# EAGLE design servostik (EAGLE 5.07)
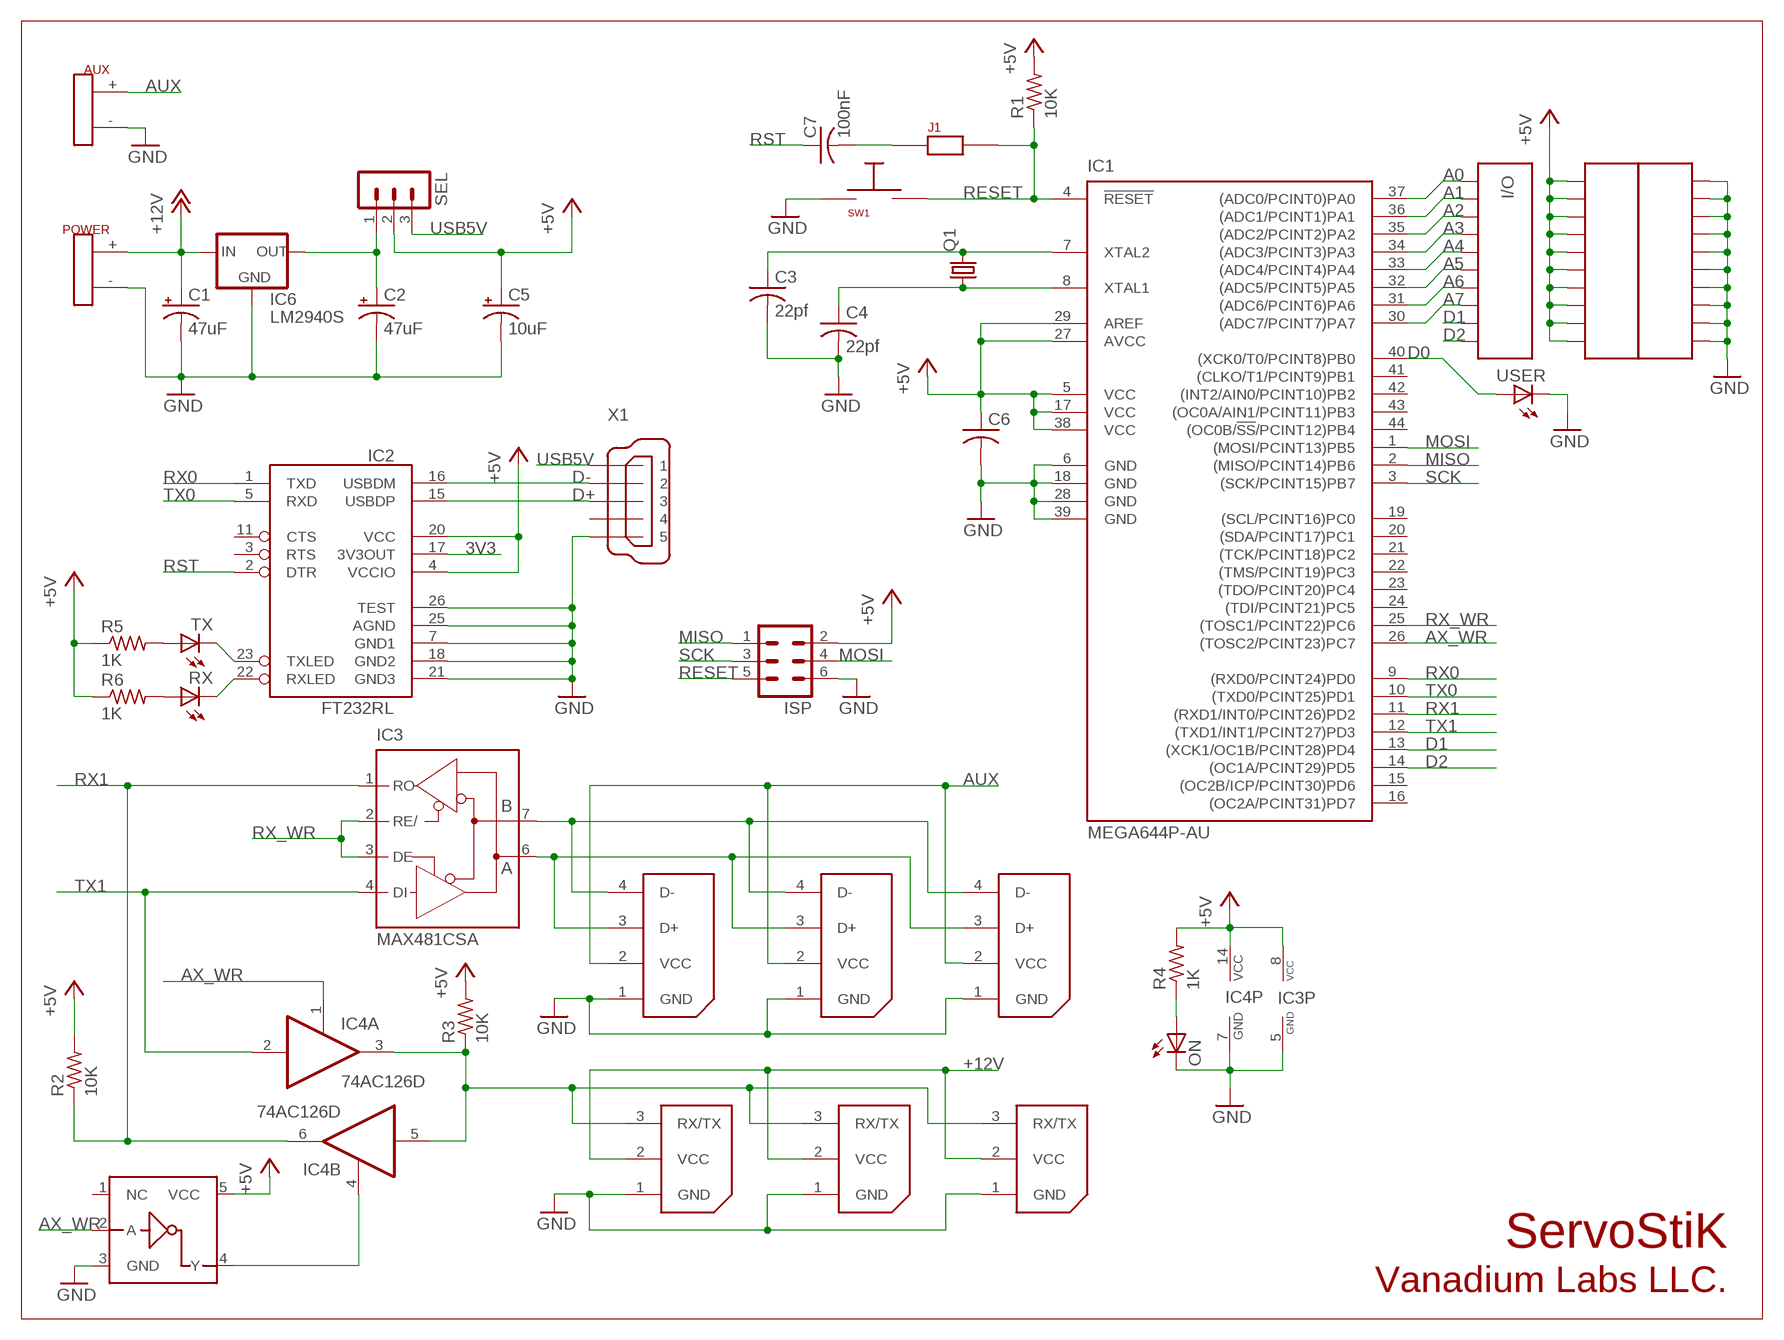
[diagram p0: schematic, sheet 1]

## Parts
AUX  POWER  [POWER]
AX1  WM18887-ND  [BIOLOID]
AX2  WM18887-ND  [BIOLOID]
AX3  WM18887-ND  [BIOLOID]
C1  47uF  CPOL-USTT2D5  [TT2D5]
C2  47uF  CPOL-USTT2D5  [TT2D5]
C3  22pf  C-USC0603  [C0603]
C4  22pf  C-USC0603  [C0603]
C5  10uF  CPOL-USTT2D5  [TT2D5]
C6  C-USC0603  [C0603]
C7  100nF  C-USC0603  [C0603]
IC1  MEGA644P-AU  MEGA164P/324P/644P-AU  [TQFP44]
IC2  FT232RL  FT232RL-BASICSSOP  [SSOP28DB]
IC3  MAX481CSA  [SO08]
IC4  74AC126D  [SO14]
IC5  TC7S04F  [SSOP5-0.95]
IC6  LM2940S  [TO220S]
ISP  MA03-2  [MA03-2]
J1  JUMPER  [2-PIN]
ON  LEDCHIP-LED0805  [CHIP-LED0805]
POWER  POWER  [POWER]
Q1  HC49/S  [HC49/S]
R1  10K  R-US_R0805  [R0805]
R2  10K  R-US_R0805  [R0805]
R3  10K  R-US_R0805  [R0805]
R4  1K  R-US_R0805  [R0805]
R5  1K  R-US_R0603  [R0603]
R6  1K  R-US_R0603  [R0603]
RX  LEDCHIP-LED0603  [CHIP-LED0603]
RX1  RX-64  [WM18888-ND]
RX2  RX-64  [WM18888-ND]
RX3  RX-64  [WM18888-ND]
SEL  MA03-1  [MA03-1]
SW1  400-1646-ND  [MINISW]
TX  LEDCHIP-LED0603  [CHIP-LED0603]
U$1  HEADER1X10  [1X10]
U$2  HEADER1X10  [1X10]
U$4  HEADER1X10  [1X10]
USER  LEDCHIP-LED0805  [CHIP-LED0805]
X1  MINI-USB-UX60-MB-5ST  [UX60-MB-5ST]

## Nets
3V3: IC2.17(3V3OUT)
+5V: C5.+ C6.1 IC1.5(VCC) IC1.17(VCC) IC1.27(AVCC) IC1.29(AREF) IC1.38(VCC) IC2.4(VCCIO) IC2.20(VCC) IC3.8(VCC) IC4.14(P:VCC) IC5.5(VCC) ISP.2 R1.2 R2.2 R3.2 R4.2 R5.1 R6.1 SEL.2 U$2.P$1 U$2.P$2 U$2.P$3 U$2.P$4 U$2.P$5 U$2.P$6 U$2.P$7 U$2.P$8 U$2.P$9 U$2.P$10
+12V: AX1.2(VCC) AX2.2(VCC) AX3.2(VCC) C1.+ IC6.1(IN) POWER.+
A0: IC1.37((ADC0/PCINT0)PA0) U$1.P$1
A1: IC1.36((ADC1/PCINT1)PA1) U$1.P$2
A2: IC1.35((ADC2/PCINT2)PA2) U$1.P$3
A3: IC1.34((ADC3/PCINT3)PA3) U$1.P$4
A4: IC1.33((ADC4/PCINT4)PA4) U$1.P$5
A5: IC1.32((ADC5/PCINT5)PA5) U$1.P$6
A6: IC1.31((ADC6/PCINT6)PA6) U$1.P$7
A7: IC1.30((ADC7/PCINT7)PA7) U$1.P$8
AUX: AUX.+ RX1.2(VCC) RX2.2(VCC) RX3.2(VCC)
AX_WR: IC1.26((TOSC2/PCINT23)PC7) IC4.1(A:OE) IC5.2(A)
D0: IC1.40((XCK0/T0/PCINT8)PB0) USER.A
D1: IC1.13((XCK1/OC1B/PCINT28)PD4) U$1.P$9
D2: IC1.14((OC1A/PCINT29)PD5) U$1.P$10
D+: IC2.15(USBDP) X1.3
D-: IC2.16(USBDM) X1.2
GND: AUX.- AX1.1(GND) AX2.1(GND) AX3.1(GND) C1.- C2.- C3.2 C4.2 C5.- C6.2 IC1.6(GND) IC1.18(GND) IC1.28(GND) IC1.39(GND) IC2.7(GND1) IC2.18(GND2) IC2.21(GND3) IC2.25(AGND) IC2.26(TEST) IC3.5(GND) IC4.7(P:GND) IC5.3(GND) IC6.2(GND) ISP.6 ON.C POWER.- RX1.1(GND) RX2.1(GND) RX3.1(GND) SW1.2 U$4.P$1 U$4.P$2 U$4.P$3 U$4.P$4 U$4.P$5 U$4.P$6 U$4.P$7 U$4.P$8 U$4.P$9 U$4.P$10 USER.C X1.5
MISO: IC1.2((MISO/PCINT14)PB6) ISP.1
MOSI: IC1.1((MOSI/PCINT13)PB5) ISP.4
N$1: C3.1 IC1.7(XTAL2) Q1.2
N$2: IC3.7(B) RX1.4(D-) RX2.4(D-) RX3.4(D-)
N$3: AX1.3(RX/TX) AX2.3(RX/TX) AX3.3(RX/TX) IC4.3(A:O) IC4.5(B:I) R3.1
N$4: C4.1 IC1.8(XTAL1) Q1.1
N$7: C7.2 J1.P$1
N$8: IC4.4(B:OE) IC5.4(Y)
N$10: R6.2 RX.A
N$11: R5.2 TX.A
N$12: IC3.6(A) RX1.3(D+) RX2.3(D+) RX3.3(D+)
N$17: C2.+ IC6.3(OUT) SEL.1
N$44: IC2.23(TXLED) TX.C
N$45: IC2.22(RXLED) RX.C
N$47: ON.A R4.1
RESET: IC1.4(!RESET) ISP.5 J1.P$2 R1.1 SW1.1
RST: C7.1 IC2.2(DTR)
RX0: IC1.9((RXD0/PCINT24)PD0) IC2.1(TXD)
RX1: IC1.11((RXD1/INT0/PCINT26)PD2) IC3.1(RO) IC4.6(B:O) R2.1
RX_WR: IC1.25((TOSC1/PCINT22)PC6) IC3.2(RE/) IC3.3(DE)
SCK: IC1.3((SCK/PCINT15)PB7) ISP.3
TX0: IC1.10((TXD0/PCINT25)PD1) IC2.5(RXD)
TX1: IC1.12((TXD1/INT1/PCINT27)PD3) IC3.4(DI) IC4.2(A:I)
USB5V: SEL.3 X1.1
Unconnected: IC1.15((OC2B/ICP/PCINT30)PD6) IC1.16((OC2A/PCINT31)PD7) IC1.19((SCL/PCINT16)PC0) IC1.20((SDA/PCINT17)PC1) IC1.21((TCK/PCINT18)PC2) IC1.22((TMS/PCINT19)PC3) IC1.23((TDO/PCINT20)PC4) IC1.24((TDI/PCINT21)PC5) IC1.41((CLKO/T1/PCINT9)PB1) IC1.42((INT2/AIN0/PCINT10)PB2) IC1.43((OC0A/AIN1/PCINT11)PB3) IC1.44((OC0B/!SS!/PCINT12)PB4) IC2.3(RTS) IC2.11(CTS) IC4.8(C:O) IC4.9(C:I) IC4.10(C:OE) IC4.11(D:O) IC4.12(D:I) IC4.13(D:OE) IC5.1(NC) X1.4

## Notes on the sheet
- I/O
- ServoStiK
- Vanadium Labs LLC.

## Library data of the parts
AUX POWER = robots:POWER
AX1-AX3 = robots:WM18887-ND: Bioloid Bus Header Digikey Part No: WM18887-ND Molex/Waldom Electronics Corp 22-03-5035
C1 C2 C5 = rcl:CPOL-US: POLARIZED CAPACITOR, American symbol
C3 C4 C6 C7 = rcl:C-US: CAPACITOR, American symbol
IC1 = avr:MEGA164P/324P/644P-AU
IC2 = SparkFun:FT232RL-BASIC: USB UART This is the simplified version of the FT232RL unit. Only what you need, nothing you don't. Spark Fun Electronics SKU : COM-00650
IC3 = maxim:MAX481CSA: RS485 TRANSEIVER
IC4 = 74xx-eu:74*126: Quad bus BUFFER, 3-state
IC5 = robots:TC7S04F
IC6 = robots:LM2940: LM2940 LDO REGULATOR
ISP = con-lstb:MA03-2: PIN HEADER
J1 = robots:JUMPER
ON RX TX USER = led:LED: LED OSRAM: - CHIPLED LG R971, LG N971, LY N971, LG Q971, LY Q971, LO R971, LY R971 LH N974, LH R974 LS Q976, LO Q976, LY Q976 LO Q996 - Hyper CHIPLED LW Q18S LB Q993, LB Q99A, LB R99A - SideLED LS A670, LO A670, LY A670, LG A670, LP A670 LB A673, LV A673, LT A673, LW A673 LH A674 LY A675 LS A676, LA A676, LO A676, LY A676, LW A676 LS A679, LY A679, LG A679 - Hyper Micro SIDELED® LS Y876, LA Y876, LO Y876, LY Y876 LT Y87S - SmartLED LW L88C, LW L88S LB L89C, LB L89S, LG L890 LS L89K, LO L89K, LY L89K LS L896, LA L896, LO L896, LY L896 - TOPLED LS T670, LO T670, LY T670, LG T670, LP T670 LSG T670, LSP T670, LSY T670, LOP T670, LYG T670 LG T671, LOG T671, LSG T671 LB T673, LV T673, LT T673, LW T673 LH T674 LS T676, LA T676, LO T676, LY T676, LB T676, LH T676, LSB T676, LW T676 LB T67C, LV T67C, LT T67C, LS T67K, LO T67K, LY T67K, LW E67C LS E67B, LA E67B, LO E67B, LY E67B, LB E67C, LV E67C, LT E67C LW T67C LS T679, LY T679, LG T679 LS T770, LO T770, LY T770, LG T770, LP T770 LB T773, LV T773, LT T773, LW T773 LH T774 LS E675, LA E675, LY E675, LS T675 LS T776, LA T776, LO T776, LY T776, LB T776 LHGB T686 LT T68C, LB T68C - Hyper Mini TOPLED® LB M676 - Mini TOPLED Santana® LG M470 LS M47K, LO M47K, LY M47K Source: http://www.osram.convergy.de LUXEON: - LUMILED® LXK2-PW12-R00, LXK2-PW12-S00, LXK2-PW14-U00, LXK2-PW14-V00 LXK2-PM12-R00, LXK2-PM12-S00, LXK2-PM14-U00 LXK2-PE12-Q00, LXK2-PE12-R00, LXK2-PE12-S00, LXK2-PE14-T00, LXK2-PE14-U00 LXK2-PB12-K00, LXK2-PB12-L00, LXK2-PB12-M00, LXK2-PB14-N00, LXK2-PB14-P00, LXK2-PB14-Q00 LXK2-PR12-L00, LXK2-PR12-M00, LXK2-PR14-Q00, LXK2-PR14-R00 LXK2-PD12-Q00, LXK2-PD12-R00, LXK2-PD12-S00 LXK2-PH12-R00, LXK2-PH12-S00 LXK2-PL12-P00, LXK2-PL12-Q00, LXK2-PL12-R00 Source: www.luxeon.com KINGBRIGHT: KA-3528ASYC Source: www.kingbright.com
Q1 = crystal:HC49/S: CRYSTAL
R1-R6 = rcl:R-US_: RESISTOR, American symbol
RX1-RX3 = robots:RX-64
SEL = con-lstb:MA03-1: PIN HEADER
SW1 = robots:400-1646-ND: Mini Switch
U$1 U$2 U$4 = robots:HEADER1X10
X1 = con-hirose:MINI-USB-: MINI USB Connector Source: http://www.hirose.co.jp/cataloge_hp/e24000019.pdf

## Board
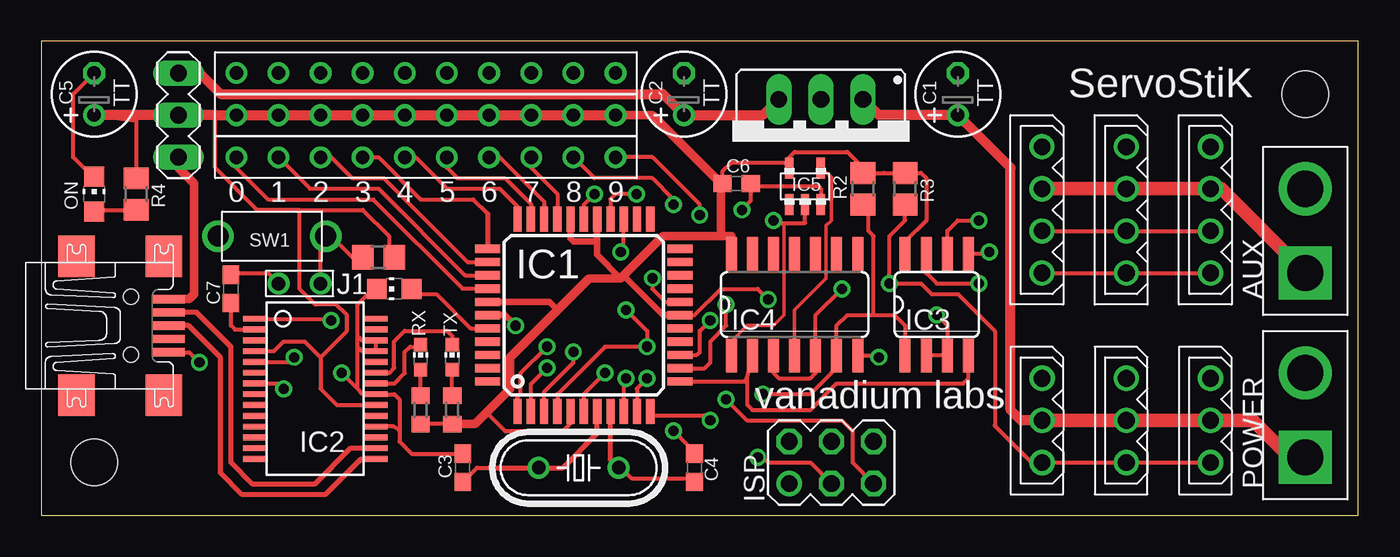
[diagram p1: board, top side]
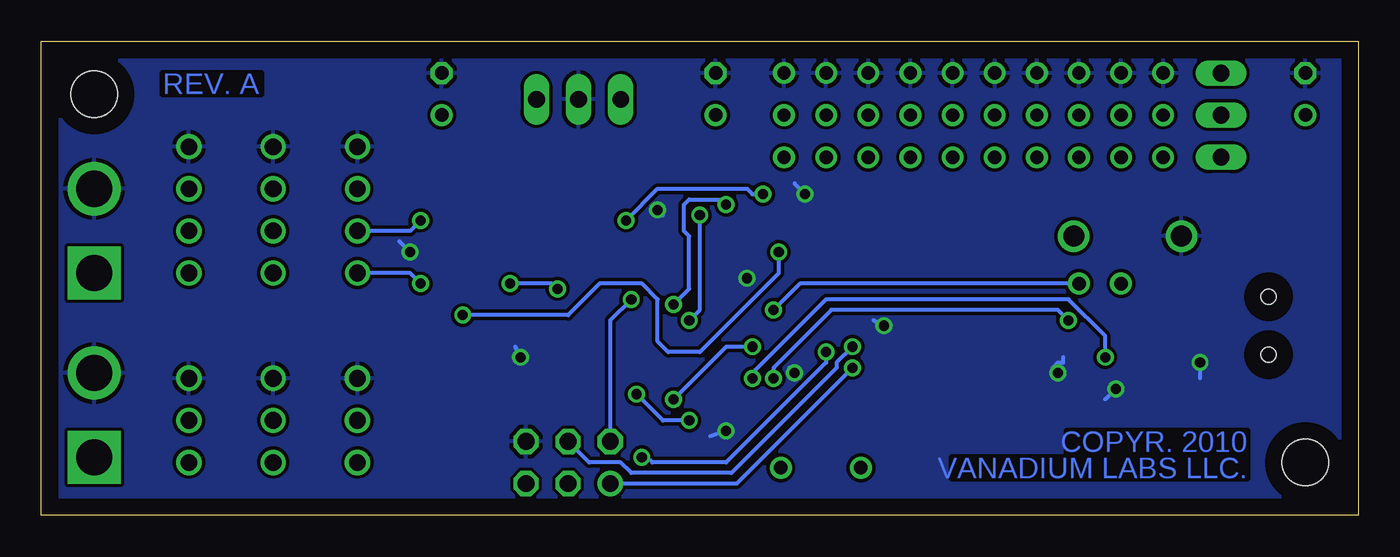
[diagram p2: board, bottom side, seen from below]

Size 79.38 x 28.57 mm. Coordinates in mm from the lower left corner, seen from the top.
Outline: 0,0 79.38,0 79.38,28.57 0,28.57 0,0
Copper layers (1*16): Top 0.035mm / dielectric 1.5mm / Bottom 0.035mm
Design rules "default *": minimum track width 8mil, minimum drill 24mil, track to track 8mil, track to pad 8mil, pad to pad 8mil, via to via 8mil, smd to smd 8mil, copper to edge 40mil, drill to drill 8mil, minimum pad ring 10mil, minimum via ring 8mil, stop-mask expansion 4mil, vias tented up to drill 24mil, thermal gap 10mil
Holes 2.8 mm at 76.2,25.4 3.17,3.17

### Footprints (pad centres in the part's own frame; a part is rotated, then mirrored left to right if it is on the bottom)
POWER = drill 2.184 square: + 0,0 | drill 2.184 round: - 5.08,0
BIOLOID = drill 1.016 round: 1 0,0; 2 2.54,0; 3 5.08,0
TT2D5 = drill 0.813 round: + -1.27,0 | drill 0.813 octagon: - 1.27,0
C0603 = smd 1.1 x 1: 1 -0.85,0; 2 0.85,0
TQFP44 = smd 1.5 x 0.5: 1 -5.8,4; 2 -5.8,3.2; 3 -5.8,2.4; 4 -5.8,1.6; 5 -5.8,0.8; 6 -5.8,0; 7 -5.8,-0.8; 8 -5.8,-1.6; 9 -5.8,-2.4; 10 -5.8,-3.2; 11 -5.8,-4; 23 5.8,-4; 24 5.8,-3.2; 25 5.8,-2.4; 26 5.8,-1.6; 27 5.8,-0.8; 28 5.8,0; 29 5.8,0.8; 30 5.8,1.6; 31 5.8,2.4; 32 5.8,3.2; 33 5.8,4 | smd 0.5 x 1.5: 12 -4,-5.8; 13 -3.2,-5.8; 14 -2.4,-5.8; 15 -1.6,-5.8; 16 -0.8,-5.8; 17 0,-5.8; 18 0.8,-5.8; 19 1.6,-5.8; 20 2.4,-5.8; 21 3.2,-5.8; 22 4,-5.8; 34 4,5.8; 35 3.2,5.8; 36 2.4,5.8; 37 1.6,5.8; 38 0.8,5.8; 39 0,5.8; 40 -0.8,5.8; 41 -1.6,5.8; 42 -2.4,5.8; 43 -3.2,5.8; 44 -4,5.8
SSOP28DB = smd 0.348 x 1.397: 1 -4.225,-3.656; 2 -3.575,-3.656; 3 -2.925,-3.656; 4 -2.275,-3.656; 5 -1.625,-3.656; 6 -0.975,-3.656; 7 -0.325,-3.656; 8 0.325,-3.656; 9 0.975,-3.656; 10 1.625,-3.656; 11 2.275,-3.656; 12 2.925,-3.656; 13 3.575,-3.656; 14 4.225,-3.656; 15 4.225,3.656; 16 3.575,3.656; 17 2.925,3.656; 18 2.275,3.656; 19 1.625,3.656; 20 0.975,3.656; 21 0.325,3.656; 22 -0.325,3.656; 23 -0.975,3.656; 24 -1.625,3.656; 25 -2.275,3.656; 26 -2.925,3.656; 27 -3.575,3.656; 28 -4.225,3.656
SO08 = smd 0.66 x 2.032: 1 -1.905,-3.073; 2 -0.635,-3.073; 3 0.635,-3.073; 4 1.905,-3.073; 5 1.905,3.073; 6 0.635,3.073; 7 -0.635,3.073; 8 -1.905,3.073
SO14 = smd 0.66 x 2.032: 1 -3.81,-3.073; 2 -2.54,-3.073; 3 -1.27,-3.073; 4 0,-3.073; 5 1.27,-3.073; 6 2.54,-3.073; 7 3.81,-3.073; 8 3.81,3.073; 9 2.54,3.073; 10 1.27,3.073; 11 0,3.073; 12 -1.27,3.073; 13 -2.54,3.073; 14 -3.81,3.073
SSOP5-0.95 = smd 1.27 x 0.5: 1 0,0; 2 0,-0.95; 3 0,-1.9; 4 2.2,-1.9; 5 2.2,0
TO220S = drill 1.016 long: 1 -2.54,1.27; 2 0,1.27; 3 2.54,1.27
MA03-2 = drill 1.016 round: 1 -2.54,-1.27 | drill 1.016 octagon: 2 -2.54,1.27; 3 0,-1.27; 4 0,1.27; 5 2.54,-1.27; 6 2.54,1.27
2-PIN = drill 0.813 round: P$1 -1.27,0; P$2 1.27,0
CHIP-LED0805 = smd 1.2 x 1.2: A 0,-1.05; C 0,1.05
HC49/S = drill 0.813 round: 1 -2.413,0; 2 2.413,0
R0805 = smd 1.3 x 1.5: 1 -0.95,0; 2 0.95,0
R0603 = smd 1 x 1.1: 1 -0.85,0; 2 0.85,0
CHIP-LED0603 = smd 0.8 x 0.8: A 0,-0.75; C 0,0.75
WM18888-ND = drill 1 round: 1 0,0; 2 -2.54,0; 3 -5.08,0; 4 -7.62,0
MA03-1 = drill 1.016 long: 1 -2.54,0; 2 0,0; 3 2.54,0
MINISW = drill 1.27 round: 1 0,0; 2 6.5,0
1X10 = drill 0.8 round: P$1 0,0; P$2 2.54,0; P$3 5.08,0; P$4 7.62,0; P$5 10.16,0; P$6 12.7,0; P$7 15.24,0; P$8 17.78,0; P$9 20.32,0; P$10 22.86,0
UX60-MB-5ST = smd 2 x 0.5: 1 2.25,1.6; 2 2.25,0.8; 3 2.25,0; 4 2.25,-0.8; 5 2.25,-1.6 | smd 2.2 x 2.5: M1 -3.3,-4.2; M2 -3.3,4.2; M3 2,4.2; M4 2,-4.2 | hole 0.9: 0,-1.75; 0,1.75

### Placement (x,y rotation side)
AUX  76.2,14.61 90 top
AX1  65.41,8.26 270 top
AX2  70.48,8.26 270 top
AX3  60.33,8.26 270 top
C1  55.24,25.4 90 top
C2  38.73,25.4 90 top
C3  25.4,2.86 90 top
C4  39.37,2.86 90 top
C5  3.17,25.4 90 top
C6  41.91,20 0 top
C7  11.43,13.65 90 top
IC1  32.7,12.06 90 top
IC2  16.51,7.62 270 top
IC3  53.98,12.7 0 top
IC4  45.4,12.7 0 top
IC5  45.09,18.73 90 top
IC6  46.99,26.35 180 top
ISP  47.62,3.17 0 top
J1  15.56,13.97 0 top
ON  3.17,19.37 0 top
POWER  76.2,3.49 90 top
Q1  32.38,2.86 180 top
R1  20.32,15.56 0 top
R2  49.53,19.68 90 top
R3  52.07,19.68 90 top
R4  5.71,19.37 90 top
R5  24.77,6.35 90 top
R6  22.86,6.35 90 top
RX  22.86,9.53 0 top
RX1  60.33,22.23 90 top
RX2  65.41,22.23 90 top
RX3  70.48,22.23 90 top
SEL  8.26,24.13 270 top
SW1  17.14,16.83 180 top
TX  24.77,9.53 0 top
U$1  11.75,21.59 0 top
U$2  11.75,24.13 0 top
U$4  11.75,26.67 0 top
USER  21.27,13.65 90 top
X1  5.4,11.43 0 top

### Tracks (layer width: path | path; a pad name or v marks a point on that pad's centre or on a via)
+5V  (via drill 0.61)
  Top 0.254: R4.2 5.71,23.81 C5.+ | IC3.8 52.07,16.51 53.34,17.78 53.34,20.32 53.02,20.64 R3.2 50.8,20.64 R2.2 49.22,20.95 49.22,21.27 48.58,21.91 45.4,21.91 44.94,21.45 44.94,21.27 | R5.1 R6.1 | 20.95,15.88 20.95,15.24 | 20.95,15.88 R1.2 | IC1.5 31.9,5.55 31.43,5.08 27.94,5.08 26.83,6.19 | IC1.17 39.37,12.06 40.96,13.65 43.18,13.65 v43.81,13.02 | 10.48,24.13 10.48,20.95 13.02,18.41 15.56,18.41 | 20.95,15.88 20.95,16.83 19.37,18.41 15.56,18.41 | IC2.4 14.02,9.89 14.61,10.48 15.88,10.48 16.83,9.53 | 16.83,9.53 16.83,7.62 17.8,6.64 IC2.20 | 15.56,18.41 15.56,13.65 16.51,12.7 17.78,12.7 18.41,12.06 18.41,11.11 16.83,9.53 | C6.1 41.06,20.74 41.59,21.27 44.94,21.27 | 44.94,21.27 IC5.5
  Top 0.406: IC1.17 37.47,12.06 35.08,14.45 | 33.5,16.51 33.5,15.71 34.92,14.29 | 33.5,16.51 IC1.27 | IC1.29 31.9,16.68 32.07,16.51 33.5,16.51 | IC1.38 30.63,12.87 31.11,12.38
  Top 0.508: R5.1 26.14,5.5 26.83,6.19 28.26,7.62 28.26,9.53 31.11,12.38 33.02,14.29 34.92,14.29 35.08,14.45 37.47,16.83 40.96,16.83 | 40.96,16.83 41.59,16.83 IC4.14 | 40.96,20 C6.1 | 40.96,20 36.83,24.13 U$2.P$10 | 40.96,20 40.96,16.83
  Top 0.61: C5.+ SEL.2 10.48,24.13 U$2.P$1 U$2.P$2 U$2.P$3 U$2.P$4 U$2.P$5 U$2.P$6 U$2.P$7 U$2.P$8 U$2.P$9 U$2.P$10
  Bottom 0.254: ISP.2 45.09,11.75 v43.81,13.02
+12V
  Top 0.61: AX3.2 59.05,5.71 58.42,6.35 58.42,20.95 C1.+ 50.48,24.13 IC6.1
  Top 0.813: POWER.+ 75.25,3.49 73.03,5.71 AX2.2 AX1.2 AX3.2
A0
  Top 0.254: IC1.37 25.39,13.66 20,19.05 13.65,19.05 11.75,20.95 U$1.P$1
A1
  Top 0.254: U$1.P$2 16.19,19.68 20.32,19.68 25.54,14.46 IC1.36
A2
  Top 0.254: U$1.P$3 17.46,21.59 18.73,20.32 20.64,20.32 25.69,15.27 IC1.35
A3
  Top 0.254: 26.9,18.18 26.04,19.05 22.86,19.05 20.32,21.59 U$1.P$4
  Top 0.305: 26.9,18.18 IC1.34
A4
  Top 0.254: IC1.33 28.7,18.61 27.62,19.68 24.45,19.68 22.54,21.59 U$1.P$5
A5
  Top 0.254: IC1.32 29.5,18.76 27.94,20.32 25.08,20.32 24.45,20.95 U$1.P$6
A6
  Top 0.254: IC1.31 30.3,18.91 27.62,21.59 U$1.P$7
A7
  Top 0.254: IC1.30 31.1,19.38 29.53,20.95 U$1.P$8
AUX
  Top 0.813: AUX.+ 71.12,19.68 RX3.2 RX2.2 RX1.2
AX_WR  (via drill 0.61)
  Top 0.203: 44.45,17.78 44.77,17.46 44.77,12.06 44.13,11.43 42.55,11.43 41.59,10.48 IC4.1
  Top 0.254: IC1.26 34.3,19.06 34.61,19.37 v35.88,19.37 | v44.13,17.78 44.45,17.78 44.61,17.62 46.04,17.62 46.04,19.05 IC5.2
  Bottom 0.254: v35.88,19.37 36.51,19.37 36.83,19.68 42.23,19.68 v44.13,17.78
D0
  Top 0.254: IC1.40 25.88,11.27 23.81,13.34 22.23,13.34 22.23,13.55 USER.A
D1  (via drill 0.61)
  Top 0.254: U$1.P$9 33.34,20.32 36.83,20.32 38.1,19.05 v38.1,18.73 | IC1.13 39.98,8.87 40.32,9.21 40.32,10.48 41.27,11.43 v41.27,12.7
  Bottom 0.254: v41.27,12.7 40.32,13.65 40.32,16.83 40.64,17.14 40.64,18.73 40.32,19.05 38.1,19.05 v38.1,18.73
D2  (via drill 0.61)
  Top 0.254: U$1.P$10 36.83,21.59 39.69,18.73 v39.69,18.1 | IC1.14 39.51,9.66 39.69,9.84 39.69,11.11 v40.32,11.75
  Bottom 0.254: v40.32,11.75 39.69,12.38 v39.69,18.1
D+
  Top 0.305: X1.3 8.89,11.43 10.79,9.53 10.79,2.54 12.06,1.27 17.14,1.27 19.27,3.4 IC2.15
D-
  Top 0.305: X1.2 9.36,12.23 11.43,10.16 11.43,3.17 12.7,1.91 16.51,1.91 18.65,4.04 IC2.16
GND  (via drill 0.61)
  Top 0.254: X1.5 8.9,9.83 v9.53,9.21 | IC3.5 57.05,15.77 v57.15,15.88 | IC2.7 14.28,7.95 v14.61,7.62 | 21.59,5.08 21.59,6.99 21.28,7.29 IC2.21 19.38,7.29 19.05,7.62 | IC2.18 21.22,5.34 21.59,5.08 | 21.59,5.08 21.59,4.45 22.33,3.71 C3.2 | USER.C 20,13.65 19.05,12.7 19.05,10.79 | 19.05,10.79 19.3,10.54 IC2.26 IC2.25 19.32,9.89 19.05,10.16 | 19.05,10.16 19.05,10.79 | 19.05,7.62 19.05,10.16 | IC4.7 50.38,9.63 v50.48,9.53 | IC1.6 32.7,7.3 v33.97,8.57 | IC1.28 32.7,18.73 v33.34,19.37 | 39.47,3.71 C4.2 39.37,3.81 v38.1,5.08 | 19.05,7.62 v18.1,8.57 | ON.C 3.08,20.42 1.91,21.59 1.91,25.4 C5.- | v42.23,18.41 42.76,18.95 C6.2 42.76,19.95 42.86,19.84 46.83,19.84 46.98,19.69 IC5.3 | IC1.18 37.62,12.87 36.83,13.65 v36.83,14.29
  Top 0.406: IC1.39 27.94,12.06 v28.57,11.43
  Bottom 0.254: v57.15,15.88 57.78,16.51 | v28.57,11.43 29.21,11.75 | v9.53,9.21 9.53,8.26 | v14.61,7.62 15.24,6.99 | v50.48,9.53 50.8,10.16 | v33.34,19.37 33.97,20 | v33.97,8.57 34.29,8.89 | v18.1,8.57 18.41,8.89 18.1,9.21 17.78,9.21 17.78,9.53 | v38.1,5.08 39.05,4.76 | v42.23,18.41 41.91,18.1 | v36.83,14.29 36.83,14.61
  pour Bottom: 0.64,27.3 0.64,0.64 78.74,0.64 78.74,27.94 0.64,27.94
MISO  (via drill 0.61)
  Top 0.254: IC1.2 29.5,7.91 v30.48,8.89
  Bottom 0.254: v30.48,8.89 37.47,1.91 ISP.1
MOSI  (via drill 0.61)
  Top 0.254: IC1.1 28.7,7.11 28.89,7.3 28.89,8.57 v30.48,10.16
  Bottom 0.254: v30.48,10.16 31.43,9.21 31.43,8.89 37.78,2.54 43.81,2.54 44.45,3.17 46.35,3.17 ISP.4
N$1
  Top 0.254: 26.99,2.86 26.25,2.86 C3.1
  Top 0.305: IC1.7 33.5,4.93 31.43,2.86 Q1.2 26.99,2.86
N$2  (via drill 0.61)
  Top 0.254: RX1.4 RX2.4 RX3.4 | v56.52,13.97 53.98,13.97 53.34,14.61 IC3.7
  Bottom 0.254: RX1.4 57.15,14.61 v56.52,13.97
N$3  (via drill 0.61)
  Top 0.254: AX2.3 AX1.3 AX3.3 59.69,3.17 57.47,5.4 57.47,11.11 55.24,13.34 53.66,13.34 53.02,13.97 v51.12,13.97 51.12,16.83 52.07,17.78 R3.1 | IC4.3 44.13,8.57 44.45,8.26 46.35,8.26 46.67,8.57 IC4.5 46.67,12.06 v48.26,13.65
  Bottom 0.254: v48.26,13.65 48.58,13.97 v51.12,13.97
N$4
  Top 0.254: Q1.1 34.92,2.86 35.56,2.22 39.16,2.22 C4.1
  Top 0.305: IC1.8 34.3,3.35 Q1.1
N$7
  Top 0.254: C7.2 11.43,14.61 13.65,14.61 J1.P$1
N$8
  Top 0.203: IC4.4 45.4,12.38 47.31,14.29 47.31,17.46 47.64,17.77 47.64,20.39 IC5.4
N$10
  Top 0.254: R6.2 RX.A
N$11
  Top 0.254: R5.2 TX.A
N$12  (via drill 0.61)
  Top 0.254: RX1.3 RX2.3 RX3.3 | v56.52,17.78 55.24,17.78 54.61,17.14 IC3.6
  Bottom 0.254: RX1.3 57.15,17.14 v56.52,17.78
N$17
  Top 0.61: SEL.1 9.53,26.67 10.79,25.4 37.47,25.4 C2.+ 43.5,24.13 IC6.3
N$44
  Top 0.254: IC2.23 20.98,8.6 21.27,8.89 21.27,10.48 21.91,11.11 24.45,11.11 24.77,10.79 TX.C
N$45
  Top 0.254: IC2.22 21.28,7.95 21.91,8.57 21.91,9.84 22.23,10.16 22.75,10.16 RX.C
N$47
  Top 0.254: R4.1 3.27,18.42 ON.A
RESET  (via drill 0.61)
  Top 0.254: J1.P$2 16.83,16.51 SW1.1 17.14,17.14 18.73,15.56 R1.1 | IC1.4 31.1,7.29 33.97,10.16 v36.51,10.16 36.51,11.11 v35.24,12.38 | ISP.5 48.9,3.17 48.9,5.08 48.26,5.71 42.55,5.71 v41.27,6.99
  Bottom 0.254: v35.24,12.38 33.66,13.97 J1.P$2 | v41.27,6.99 38.1,10.16 v36.51,10.16
RST
  Top 0.254: IC2.2 11.66,11.2 11.43,11.43 C7.1
RX0  (via drill 0.61)
  Top 0.254: IC1.9 35.1,8.12 v35.24,8.26 | IC2.1 17.56,11.85 v17.46,11.75
  Bottom 0.254: v35.24,8.26 35.24,8.89 31.75,12.38 18.1,12.38 v17.46,11.75
RX1  (via drill 0.61)
  Top 0.254: 50.16,12.06 50.16,16.83 49.85,17.14 49.85,18.41 R2.1 | IC3.1 52.07,11.43 51.44,12.06 50.16,12.06 | 50.16,12.06 48.58,12.06 47.94,11.43 IC4.6 47.94,8.89 46.35,7.3 v43.5,7.3 | IC1.11 36.83,5.71 36.83,6.03 40.01,6.03 v40.32,5.71
  Bottom 0.254: v40.32,5.71 41.91,5.71 v43.5,7.3
RX_WR  (via drill 0.61)
  Top 0.254: IC3.2 IC3.3 54.61,11.43 v53.98,12.06 | IC1.25 35.1,16.02 v34.92,15.88
  Bottom 0.254: v34.92,15.88 34.92,14.61 39.69,9.84 41.59,9.84 42.23,10.48 42.23,13.02 43.18,13.97 45.72,13.97 47.62,12.06 v53.98,12.06
SCK  (via drill 0.61)
  Top 0.254: IC1.3 30.3,7.44 32.07,9.21 v32.07,9.84 | v43.18,3.49 43.5,3.49 43.81,3.17 46.35,3.17 ISP.3
  Bottom 0.254: v32.07,9.84 32.07,9.21 38.1,3.17 42.55,3.17 42.86,3.49 v43.18,3.49
TX0  (via drill 0.61)
  Top 0.254: IC1.10 35.9,7.64 v36.51,8.26 | IC2.5 14.96,9.24 v15.24,9.53
  Bottom 0.254: v36.51,8.26 36.51,8.57 32.07,13.02 17.46,13.02 15.24,10.79 v15.24,9.53
TX1
  Top 0.254: 42.55,8.26 42.35,8.06 IC1.12 | 42.55,8.26 IC4.2 | IC3.4 55.88,8.26 55.56,7.94 47.94,7.94 46.35,6.35 42.86,6.35 42.55,6.67 42.55,8.26
USB5V
  Top 0.508: X1.1 8.9,13.03 9.21,13.34 9.21,20 8.26,20.95 SEL.3

### Text on the board
Bottom: REV. A | COPYR. 2010 | VANADIUM LABS LLC.
tPlace: ServoStiK
tNames: IC5 | 0 | 1 | 2 | 3 | 4 | 5 | 6 | 7 | 8 | 9 | vanadium labs